# EAGLE schematic FlightPCB (EAGLE 9.6.2)
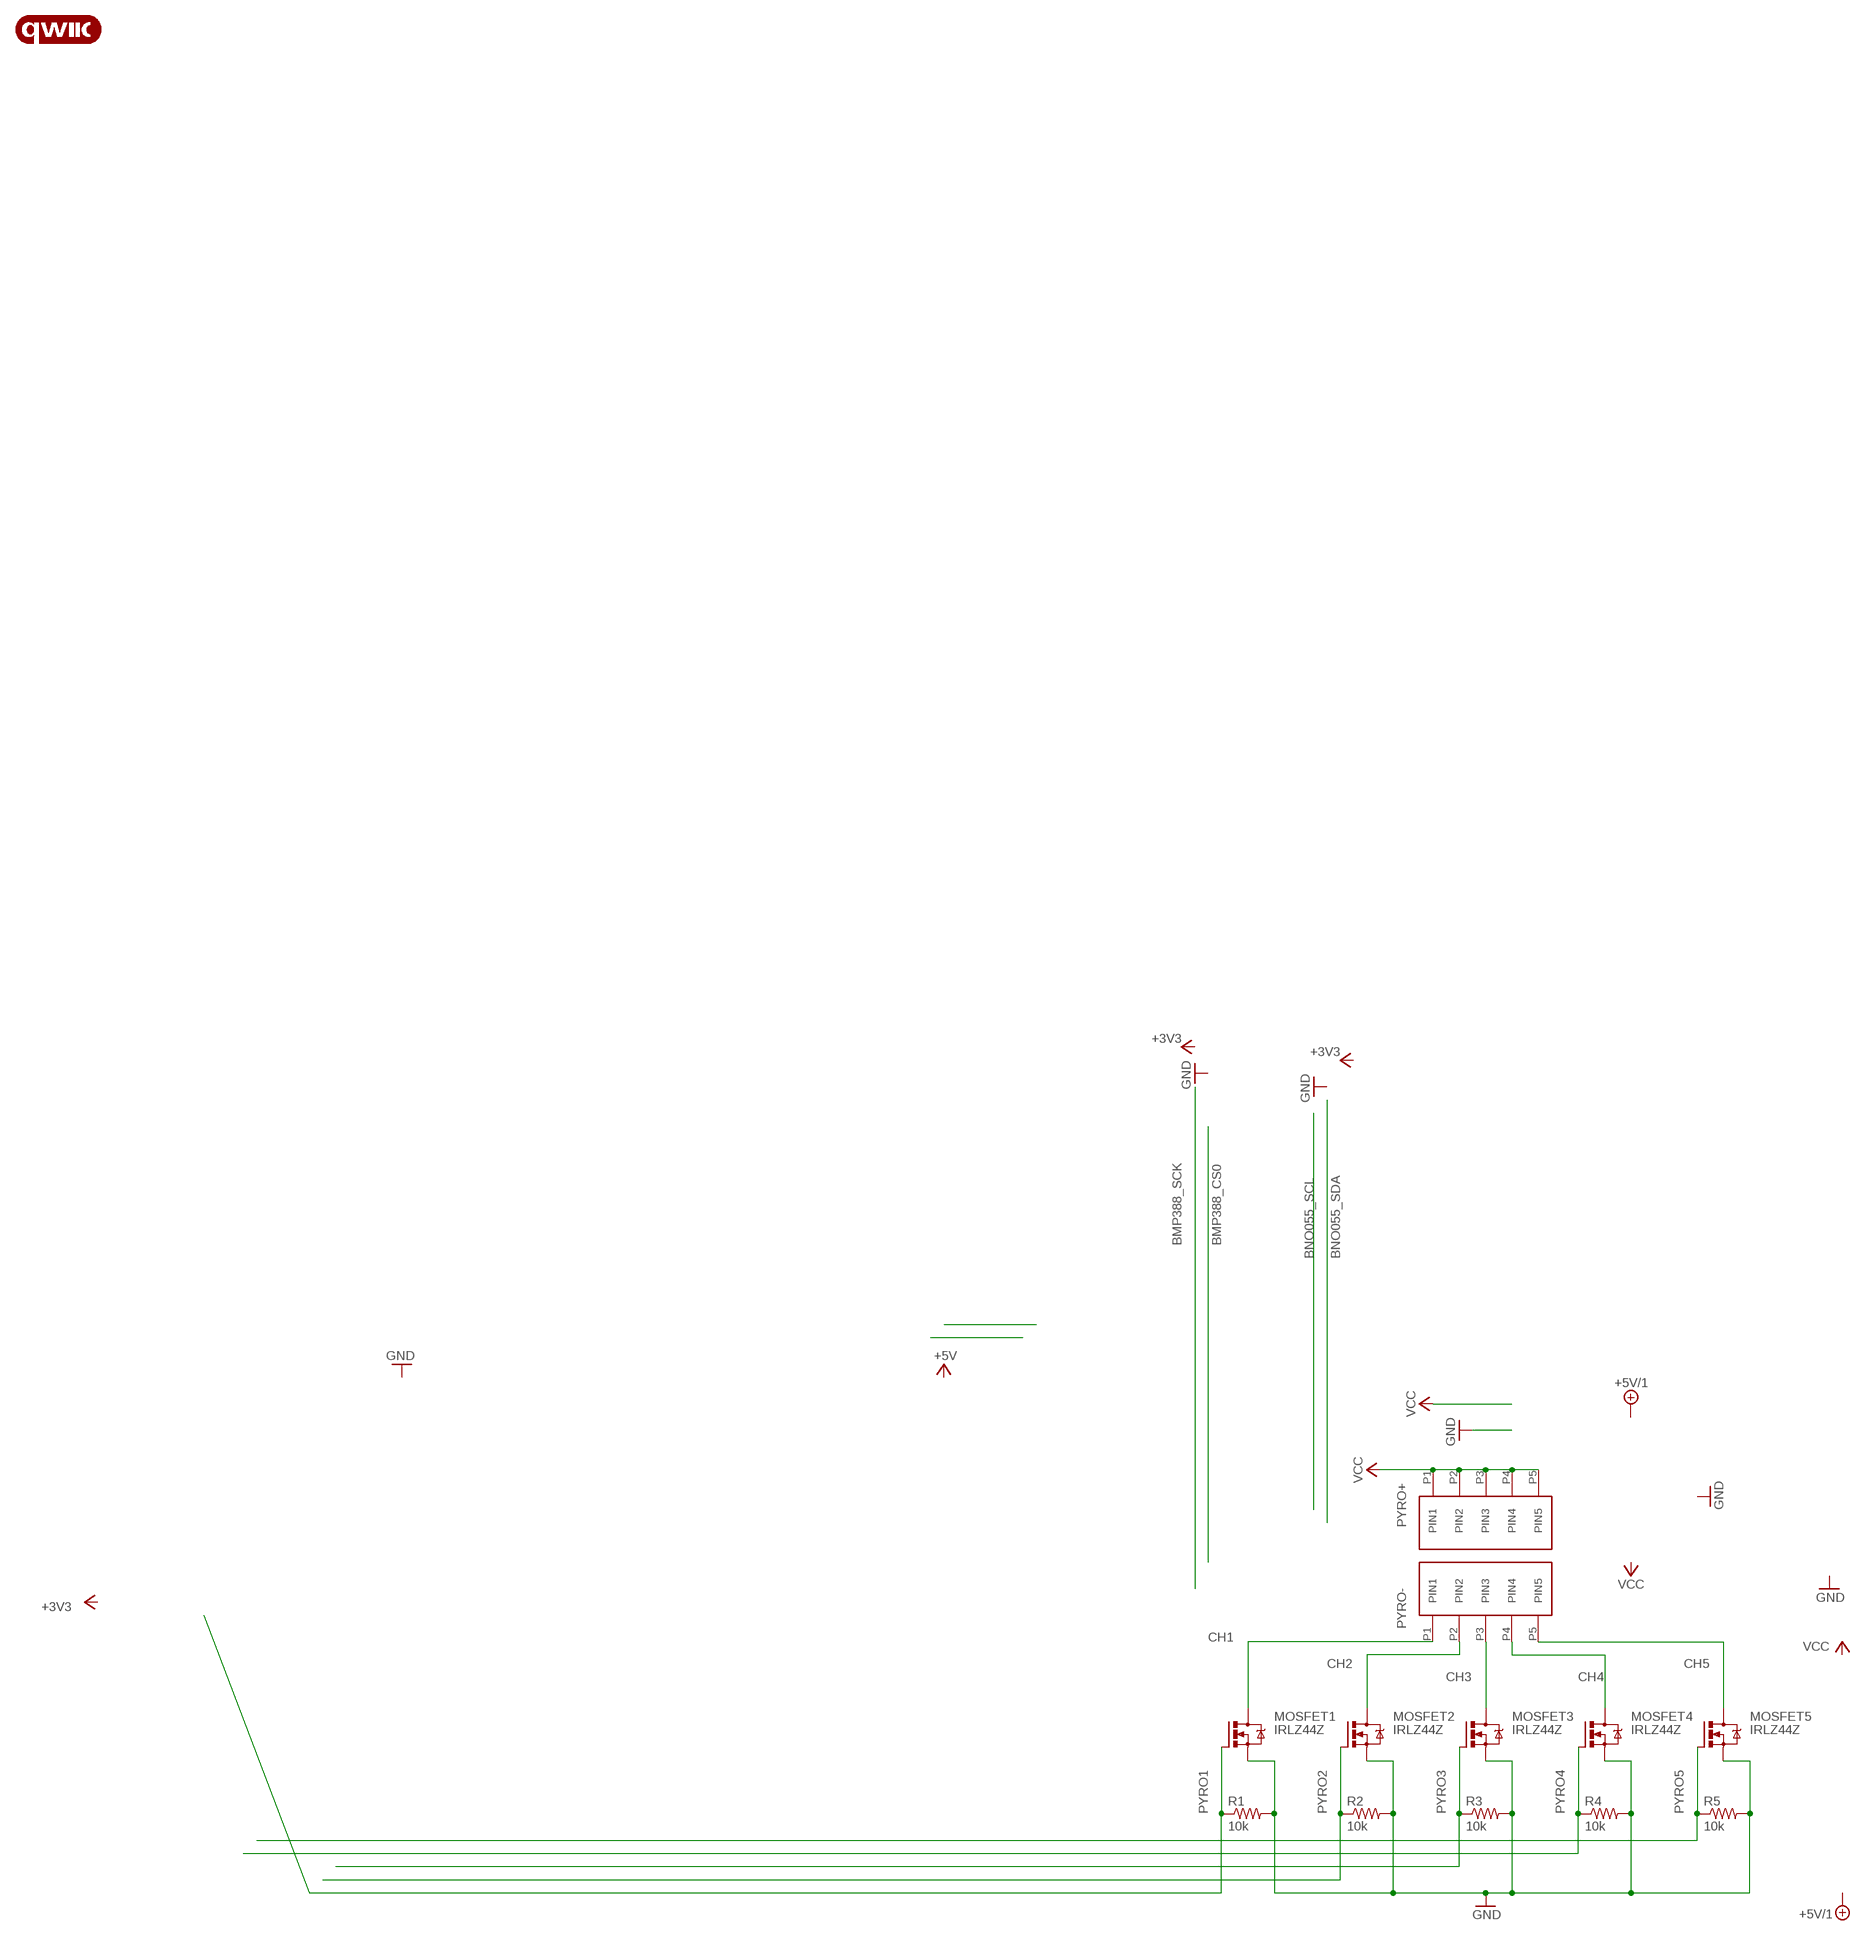
[diagram p0: schematic, sheet 1]

## Parts
LOGO1  QWIIC_LOGO_3MM  [QWIIC_3MM]
MOSFET1  IRLZ44Z  [TO220BH_SIMPLE]
MOSFET2  IRLZ44Z  [TO220BH_SIMPLE]
MOSFET3  IRLZ44Z  [TO220BH_SIMPLE]
MOSFET4  IRLZ44Z  [TO220BH_SIMPLE]
MOSFET5  IRLZ44Z  [TO220BH_SIMPLE]
PYRO+  TERMINAL_BLOCK_5_PIN_5MM  [TERMINAL_BLOCK_5_PIN_5MM]
PYRO-  TERMINAL_BLOCK_5_PIN_5MM  [TERMINAL_BLOCK_5_PIN_5MM]
R1  10k  R-US_0204/7  [0204/7]
R2  10k  R-US_0204/7  [0204/7]
R3  10k  R-US_0204/7  [0204/7]
R4  10k  R-US_0204/7  [0204/7]
R5  10k  R-US_0204/7  [0204/7]

## Nets
CH1: MOSFET1.D PYRO-.P1(PIN1)
CH2: MOSFET2.D PYRO-.P2(PIN2)
CH3: MOSFET3.D PYRO-.P3(PIN3)
CH4: MOSFET4.D PYRO-.P4(PIN4)
CH5: MOSFET5.D PYRO-.P5(PIN5)
GND [Power Delivery]: MOSFET1.S MOSFET2.S MOSFET3.S MOSFET4.S MOSFET5.S R1.2 R2.2 R3.2 R4.2 R5.2
PYRO1: MOSFET1.G R1.1
PYRO2: MOSFET2.G R2.1
PYRO3: MOSFET3.G R3.1
PYRO4: MOSFET4.G R4.1
PYRO5: MOSFET5.G R5.1
VCC [Power Delivery]: PYRO+.P1(PIN1) PYRO+.P2(PIN2) PYRO+.P3(PIN3) PYRO+.P4(PIN4) PYRO+.P5(PIN5)

## Library data of the parts
LOGO1 = SparkFun-Aesthetics:QWIIC_LOGO: Qwiic Logos for placement on schematic and PCB. The 5.5mm silk logo is best for placing next to Qwiic connector.
MOSFET1-MOSFET5 = transistor-power_MOD:IRLZ44Z: N-Channel HEXFET® Power MOSFET Logic Level AUTOMOTIVE MOSFET Source: http://www.irf.com/product-info/datasheets/data/irlz44zpbf.pdf
PYRO+ PYRO- = MattMtzLPRD:TERMINAL_BLOCK_5_PIN_5MM: 5 Pin Terminal Block. 5mm spacing
R1-R5 = rcl:R-US_: RESISTOR, American symbol; SPICEPREFIX: R

## Net classes
1 Power Delivery: width 0.25 mm